# EAGLE design IOB-Baseboard (EAGLE 7.7.0)

## Sheet 1 of 2
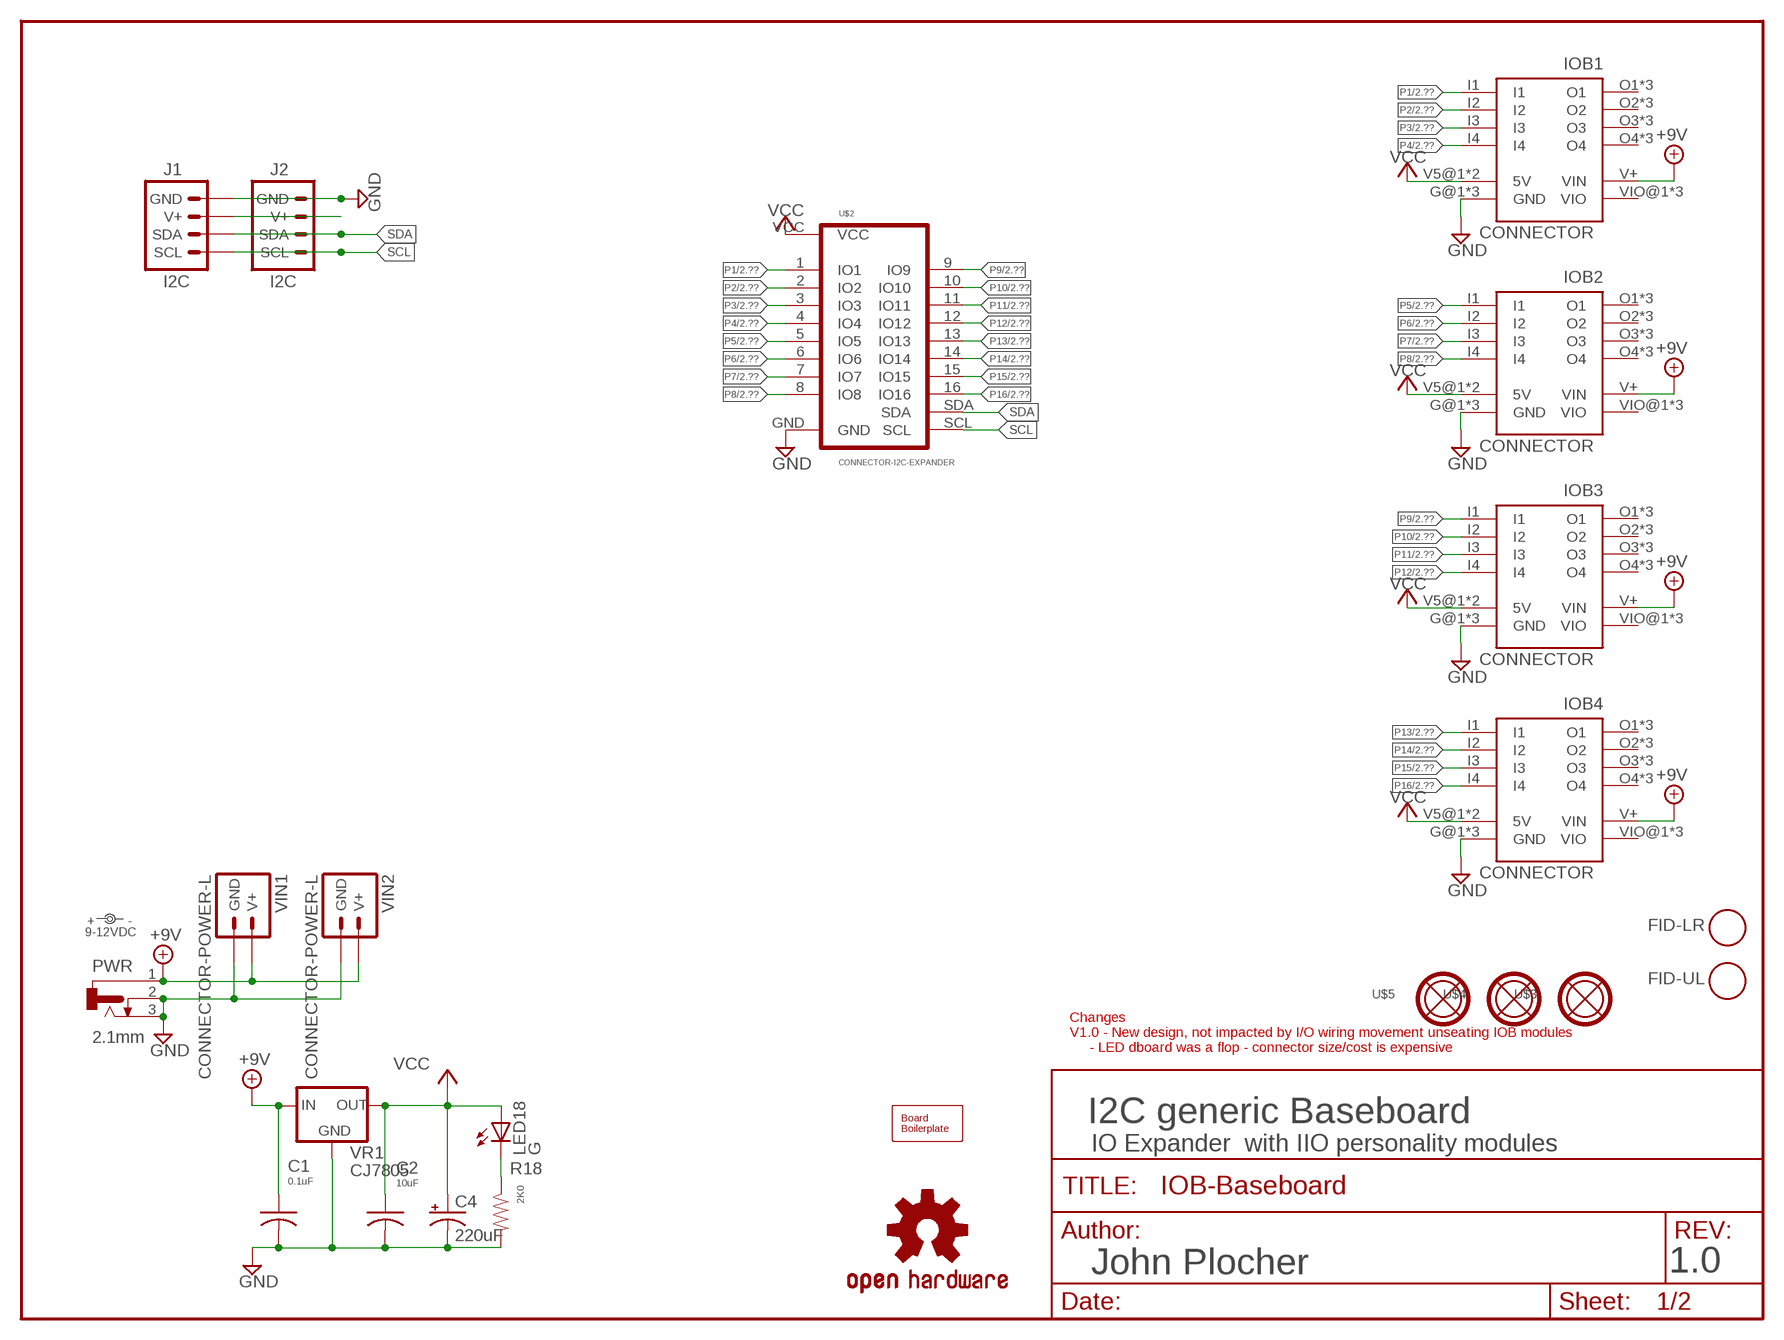
[diagram p0: schematic, sheet 1]

### Parts
BOARD1  BOARD  BOARD80X100-IOB  [BOARD-DINRAIL-3.17IN-IOB]
C1  0.1uF  CAP0603  [0603-CAP]
C2  10uF  CAP0603  [0603-CAP]
C4  220uF  CAP-POL0810  [0810-CAP]
FID-LR  FIDUCIAL  [FIDUCIAL_1MM]
FID-UL  FIDUCIAL  [FIDUCIAL_1MM]
IOB1  CONNECTOR  CONNECTOR-IO4-IOB-V3  [IOB-V3-BASE]
IOB2  CONNECTOR  CONNECTOR-IO4-IOB-V3  [IOB-V3-BASE]
IOB3  CONNECTOR  CONNECTOR-IO4-IOB-V3  [IOB-V3-BASE]
IOB4  CONNECTOR  CONNECTOR-IO4-IOB-V3  [IOB-V3-BASE]
J1  I2C  CONNECTOR-I2CLEFT  [I2C-L]
J2  I2C  CONNECTOR-I2CLEFT  [I2C-L]
LED18  G  LED0603-LED  [0603-LED]
PWR  2.1mm  CONNECTOR-DC-POWER-RA  [DCJ0202]
R18  2K0  R0603-RES  [0603-RES]
U$1  OSHW  OSHW-LOGOL  [OSHW-LOGO-L]
U$2  CONNECTOR-I2C-EXPANDER  [I2C-EXPANDER]
U$3  MOUNTINGHOLE  [MOUNTINGHOLE]
U$4  MOUNTINGHOLE  [MOUNTINGHOLE]
U$5  MOUNTINGHOLE  [MOUNTINGHOLE]
VIN  9-12VDC  DOC-POWER_LABEL  [PWR_LABEL]
VIN1  CONNECTOR-POWER-L  [POWER-R2]
VIN2  CONNECTOR-POWER-L  [POWER-R2]
VR1  CJ7805  VREG-DPAK-5  [TO-252]

### Nets
GND [Power]: C1.2 C2.2 C4.- IOB1.G@1(GND) IOB1.G@2(GND) IOB1.GND@3(GND) IOB2.G@1(GND) IOB2.G@2(GND) IOB2.GND@3(GND) IOB3.G@1(GND) IOB3.G@2(GND) IOB3.GND@3(GND) IOB4.G@1(GND) IOB4.G@2(GND) IOB4.GND@3(GND) J1.GND J1.GND@1(GND) J2.GND J2.GND@1(GND) PWR.2 PWR.3 R18.2 U$2.GND VIN1.GND VIN1.GND@1(GND) VIN1.GND@2(GND) VIN1.GND@3(GND) VIN2.GND VIN2.GND@1(GND) VIN2.GND@2(GND) VIN2.GND@3(GND) VR1.2(GND) ; also sheet 2
N$1: LED18.C R18.1
P1 [signals]: IOB1.I1 U$2.1(IO1) ; also sheet 2
P2 [signals]: IOB1.I2 U$2.2(IO2) ; also sheet 2
P3 [signals]: IOB1.I3 U$2.3(IO3) ; also sheet 2
P4 [signals]: IOB1.I4 U$2.4(IO4) ; also sheet 2
P5 [signals]: IOB2.I1 U$2.5(IO5) ; also sheet 2
P6 [signals]: IOB2.I2 U$2.6(IO6) ; also sheet 2
P7 [signals]: IOB2.I3 U$2.7(IO7) ; also sheet 2
P8 [signals]: IOB2.I4 U$2.8(IO8) ; also sheet 2
P9 [signals]: IOB3.I1 U$2.9(IO9) ; also sheet 2
P10 [signals]: IOB3.I2 U$2.10(IO10) ; also sheet 2
P11 [signals]: IOB3.I3 U$2.11(IO11) ; also sheet 2
P12 [signals]: IOB3.I4 U$2.12(IO12) ; also sheet 2
P13 [signals]: IOB4.I1 U$2.13(IO13) ; also sheet 2
P14 [signals]: IOB4.I2 U$2.14(IO14) ; also sheet 2
P15 [signals]: IOB4.I3 U$2.15(IO15) ; also sheet 2
P16 [signals]: IOB4.I4 U$2.16(IO16) ; also sheet 2
SCL [signals]: J1.SCL J1.SCL@1(SCL) J2.SCL J2.SCL@1(SCL) U$2.SCL
SDA [signals]: J1.SDA J1.SDA@1(SDA) J2.SDA J2.SDA@1(SDA) U$2.SDA
V+I2C: J1.V+ J1.V+@1(V+) J2.V+ J2.V+@1(V+)
VCC [Power]: C2.1 C4.+ IOB1.V5@1(5V) IOB1.V5@2(5V) IOB2.V5@1(5V) IOB2.V5@2(5V) IOB3.V5@1(5V) IOB3.V5@2(5V) IOB4.V5@1(5V) IOB4.V5@2(5V) LED18.A U$2.VCC VR1.3(OUT) ; also sheet 2
VIN [Power]: C1.1 IOB1.V+(VIN) IOB2.V+(VIN) IOB3.V+(VIN) IOB4.V+(VIN) PWR.1 VIN1.V+ VIN1.V+@1(V+) VIN1.V+@2(V+) VIN1.V+@3(V+) VIN2.V+ VIN2.V+@1(V+) VIN2.V+@2(V+) VIN2.V+@3(V+) VR1.1(IN) ; supply symbol labelled +9V
Unconnected: IOB1.O1 IOB1.O1@1(O1) IOB1.O1@2(O1) IOB1.O2 IOB1.O2@1(O2) IOB1.O2@2(O2) IOB1.O3 IOB1.O3@1(O3) IOB1.O3@2(O3) IOB1.O4 IOB1.O4@1(O4) IOB1.O4@2(O4) IOB1.VIO@1(VIO) IOB1.VIO@2(VIO) IOB1.VIO@3(VIO) IOB2.O1 IOB2.O1@1(O1) IOB2.O1@2(O1) IOB2.O2 IOB2.O2@1(O2) IOB2.O2@2(O2) IOB2.O3 IOB2.O3@1(O3) IOB2.O3@2(O3) IOB2.O4 IOB2.O4@1(O4) IOB2.O4@2(O4) IOB2.VIO@1(VIO) IOB2.VIO@2(VIO) IOB2.VIO@3(VIO) IOB3.O1 IOB3.O1@1(O1) IOB3.O1@2(O1) IOB3.O2 IOB3.O2@1(O2) IOB3.O2@2(O2) IOB3.O3 IOB3.O3@1(O3) IOB3.O3@2(O3) IOB3.O4 IOB3.O4@1(O4) IOB3.O4@2(O4) IOB3.VIO@1(VIO) IOB3.VIO@2(VIO) IOB3.VIO@3(VIO) IOB4.O1 IOB4.O1@1(O1) IOB4.O1@2(O1) IOB4.O2 IOB4.O2@1(O2) IOB4.O2@2(O2) IOB4.O3 IOB4.O3@1(O3) IOB4.O3@2(O3) IOB4.O4 IOB4.O4@1(O4) IOB4.O4@2(O4) IOB4.VIO@1(VIO) IOB4.VIO@2(VIO) IOB4.VIO@3(VIO)

### Notes on the sheet
- Changes
  V1.0 - New design, not impacted by I/O wiring movement unseating IOB modules
       - LED dboard was a flop - connector size/cost is expensive
- I2C generic Baseboard
- IO Expander  with IIO personality modules
- John Plocher | 1.0

## Sheet 2 of 2
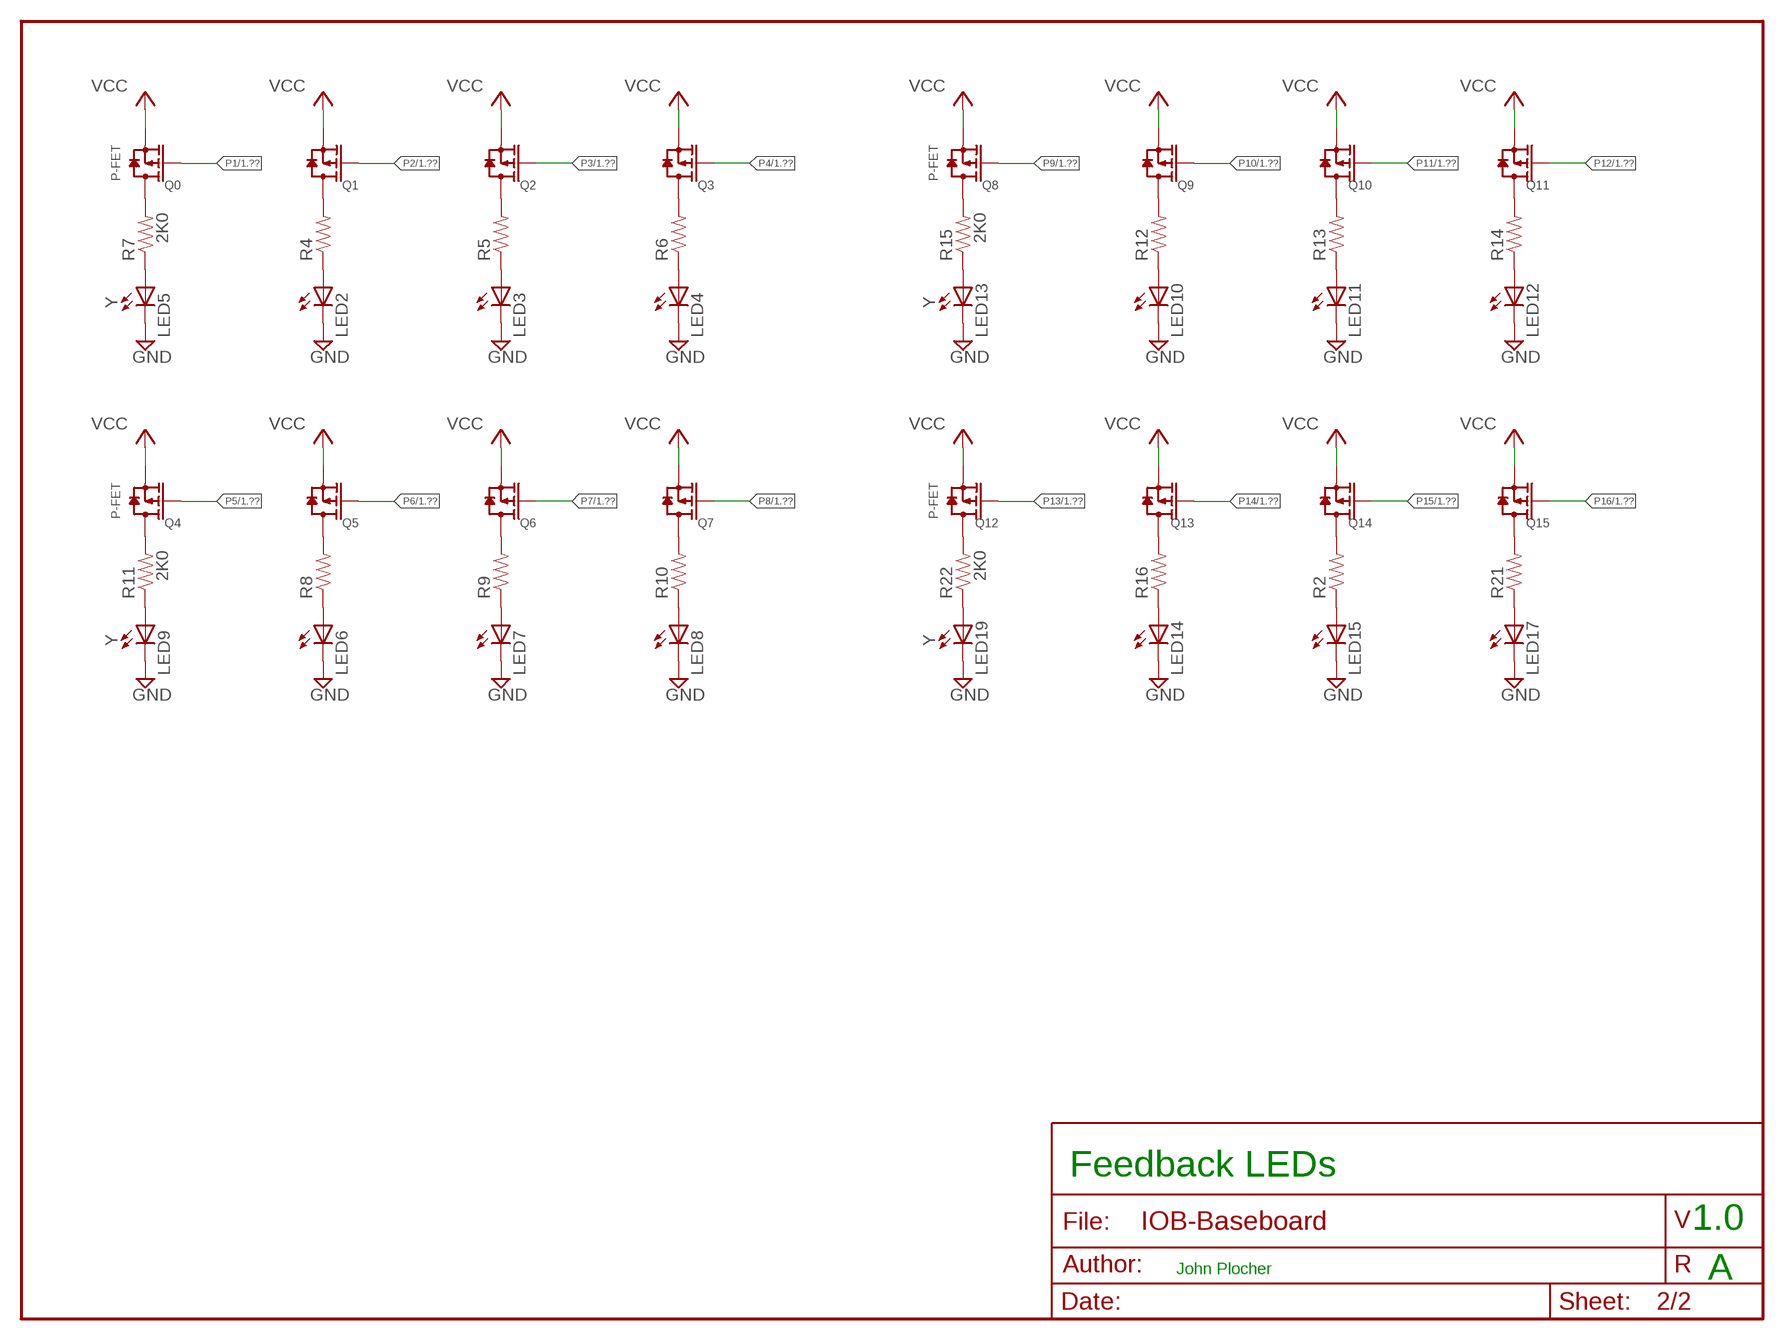
[diagram p1: schematic, sheet 2]

### Parts
LED2  Y  LED0603-LED  [0603-LED]
LED3  Y  LED0603-LED  [0603-LED]
LED4  Y  LED0603-LED  [0603-LED]
LED5  Y  LED0603-LED  [0603-LED]
LED6  Y  LED0603-LED  [0603-LED]
LED7  Y  LED0603-LED  [0603-LED]
LED8  Y  LED0603-LED  [0603-LED]
LED9  Y  LED0603-LED  [0603-LED]
LED10  Y  LED0603-LED  [0603-LED]
LED11  Y  LED0603-LED  [0603-LED]
LED12  Y  LED0603-LED  [0603-LED]
LED13  Y  LED0603-LED  [0603-LED]
LED14  Y  LED0603-LED  [0603-LED]
LED15  Y  LED0603-LED  [0603-LED]
LED17  Y  LED0603-LED  [0603-LED]
LED19  Y  LED0603-LED  [0603-LED]
Q0  P-FET  MOSFET-P-044021001  [SOT23]
Q1  P-FET  MOSFET-P-044021001  [SOT23]
Q2  P-FET  MOSFET-P-044021001  [SOT23]
Q3  P-FET  MOSFET-P-044021001  [SOT23]
Q4  P-FET  MOSFET-P-044021001  [SOT23]
Q5  P-FET  MOSFET-P-044021001  [SOT23]
Q6  P-FET  MOSFET-P-044021001  [SOT23]
Q7  P-FET  MOSFET-P-044021001  [SOT23]
Q8  P-FET  MOSFET-P-044021001  [SOT23]
Q9  P-FET  MOSFET-P-044021001  [SOT23]
Q10  P-FET  MOSFET-P-044021001  [SOT23]
Q11  P-FET  MOSFET-P-044021001  [SOT23]
Q12  P-FET  MOSFET-P-044021001  [SOT23]
Q13  P-FET  MOSFET-P-044021001  [SOT23]
Q14  P-FET  MOSFET-P-044021001  [SOT23]
Q15  P-FET  MOSFET-P-044021001  [SOT23]
R2  2K0  R0603-RES  [0603-RES]
R4  2K0  R0603-RES  [0603-RES]
R5  2K0  R0603-RES  [0603-RES]
R6  2K0  R0603-RES  [0603-RES]
R7  2K0  R0603-RES  [0603-RES]
R8  2K0  R0603-RES  [0603-RES]
R9  2K0  R0603-RES  [0603-RES]
R10  2K0  R0603-RES  [0603-RES]
R11  2K0  R0603-RES  [0603-RES]
R12  2K0  R0603-RES  [0603-RES]
R13  2K0  R0603-RES  [0603-RES]
R14  2K0  R0603-RES  [0603-RES]
R15  2K0  R0603-RES  [0603-RES]
R16  2K0  R0603-RES  [0603-RES]
R21  2K0  R0603-RES  [0603-RES]
R22  2K0  R0603-RES  [0603-RES]

### Nets
GND [Power]: LED2.C LED3.C LED4.C LED5.C LED6.C LED7.C LED8.C LED9.C LED10.C LED11.C LED12.C LED13.C LED14.C LED15.C LED17.C LED19.C ; also sheet 1
N$3: Q4.3(D) R11.2
N$4: Q5.3(D) R8.2
N$5: Q6.3(D) R9.2
N$6: Q7.3(D) R10.2
N$7: LED9.A R11.1
N$8: LED6.A R8.1
N$9: LED7.A R9.1
N$10: LED8.A R10.1
N$11: Q8.3(D) R15.2
N$12: Q9.3(D) R12.2
N$13: Q10.3(D) R13.2
N$14: Q11.3(D) R14.2
N$15: LED13.A R15.1
N$16: LED10.A R12.1
N$23: LED11.A R13.1
N$24: LED12.A R14.1
N$28: Q12.3(D) R22.2
N$29: Q13.3(D) R16.2
N$30: Q14.3(D) R2.2
N$31: Q15.3(D) R21.2
N$32: LED19.A R22.1
N$33: LED14.A R16.1
N$34: LED15.A R2.1
N$35: LED17.A R21.1
N$44: Q0.3(D) R7.2
N$45: Q1.3(D) R4.2
N$46: Q2.3(D) R5.2
N$47: Q3.3(D) R6.2
N$48: LED5.A R7.1
N$49: LED2.A R4.1
N$50: LED3.A R5.1
N$51: LED4.A R6.1
P1 [signals]: Q0.1(G) ; also sheet 1
P2 [signals]: Q1.1(G) ; also sheet 1
P3 [signals]: Q2.1(G) ; also sheet 1
P4 [signals]: Q3.1(G) ; also sheet 1
P5 [signals]: Q4.1(G) ; also sheet 1
P6 [signals]: Q5.1(G) ; also sheet 1
P7 [signals]: Q6.1(G) ; also sheet 1
P8 [signals]: Q7.1(G) ; also sheet 1
P9 [signals]: Q8.1(G) ; also sheet 1
P10 [signals]: Q9.1(G) ; also sheet 1
P11 [signals]: Q10.1(G) ; also sheet 1
P12 [signals]: Q11.1(G) ; also sheet 1
P13 [signals]: Q12.1(G) ; also sheet 1
P14 [signals]: Q13.1(G) ; also sheet 1
P15 [signals]: Q14.1(G) ; also sheet 1
P16 [signals]: Q15.1(G) ; also sheet 1
VCC [Power]: Q0.2(S) Q1.2(S) Q2.2(S) Q3.2(S) Q4.2(S) Q5.2(S) Q6.2(S) Q7.2(S) Q8.2(S) Q9.2(S) Q10.2(S) Q11.2(S) Q12.2(S) Q13.2(S) Q14.2(S) Q15.2(S) ; also sheet 1

### Notes on the sheet
- Feedback LEDs
- 1.0
- John Plocher
- A

## Library data of the parts
BOARD1 = SPCoast:BOARD
C1 C2 = SPCoast:CAP*
C4 = SPCoast:CAP-POL*
FID-LR FID-UL = SPCoast:FIDUCIAL: For use by pick and place machines to calibrate the vision/machine, 1mm By microbuilder.eu
IOB1-IOB4 = SPCoast:CONNECTOR-IO4-IOB-V3
J1 J2 = SPCoast:CONNECTOR-I2C
LED2-LED15 LED17-LED19 = SPCoast:LED*
PWR = SPCoast:CONNECTOR-DC-POWER: DC POWER JACK
Q0 Q1-Q15 = SPCoast:MOSFET-P: CJ2305：SMD MOSFET P-CH 8V-4.1A
R2 R4-R16 R18 R21 R22 = SPCoast:R*: Resistor Basic schematic elements and footprints for 0603, 1206, and PTH 1/10th watt (small) resistors.
U$1 = SparkFun:OSHW-LOGO: Open Source Hardware Logo This logo indicates the piece of hardware it is found on incorporates a OSHW license and/or adheres to the definition of open source hardware found here: http://freedomdefined.org/OSHW
U$2 = SPCoast:CONNECTOR-I2C-EXPANDER
U$3-U$5 = SPCoast:MOUNTINGHOLE: Mounting hole with top and bottom copper and stop rings
VIN = SPCoast:DOC-POWER_LABEL
VIN1 VIN2 = SPCoast:CONNECTOR-POWER
VR1 = SPCoast:VREG-?-*: Voltage Regulator Standard linear regulator. 7805 uses IGO pinout LM1117 uses GOI pinout

## Net classes
0 default: width 0.254 mm, drill 0.4 mm, clearance 0.127 mm
1 Power: width 0.254 mm, drill 0.4 mm, clearance 0.127 mm
2 signals: width 0.254 mm, drill 0.4 mm, clearance 0.127 mm

## Board
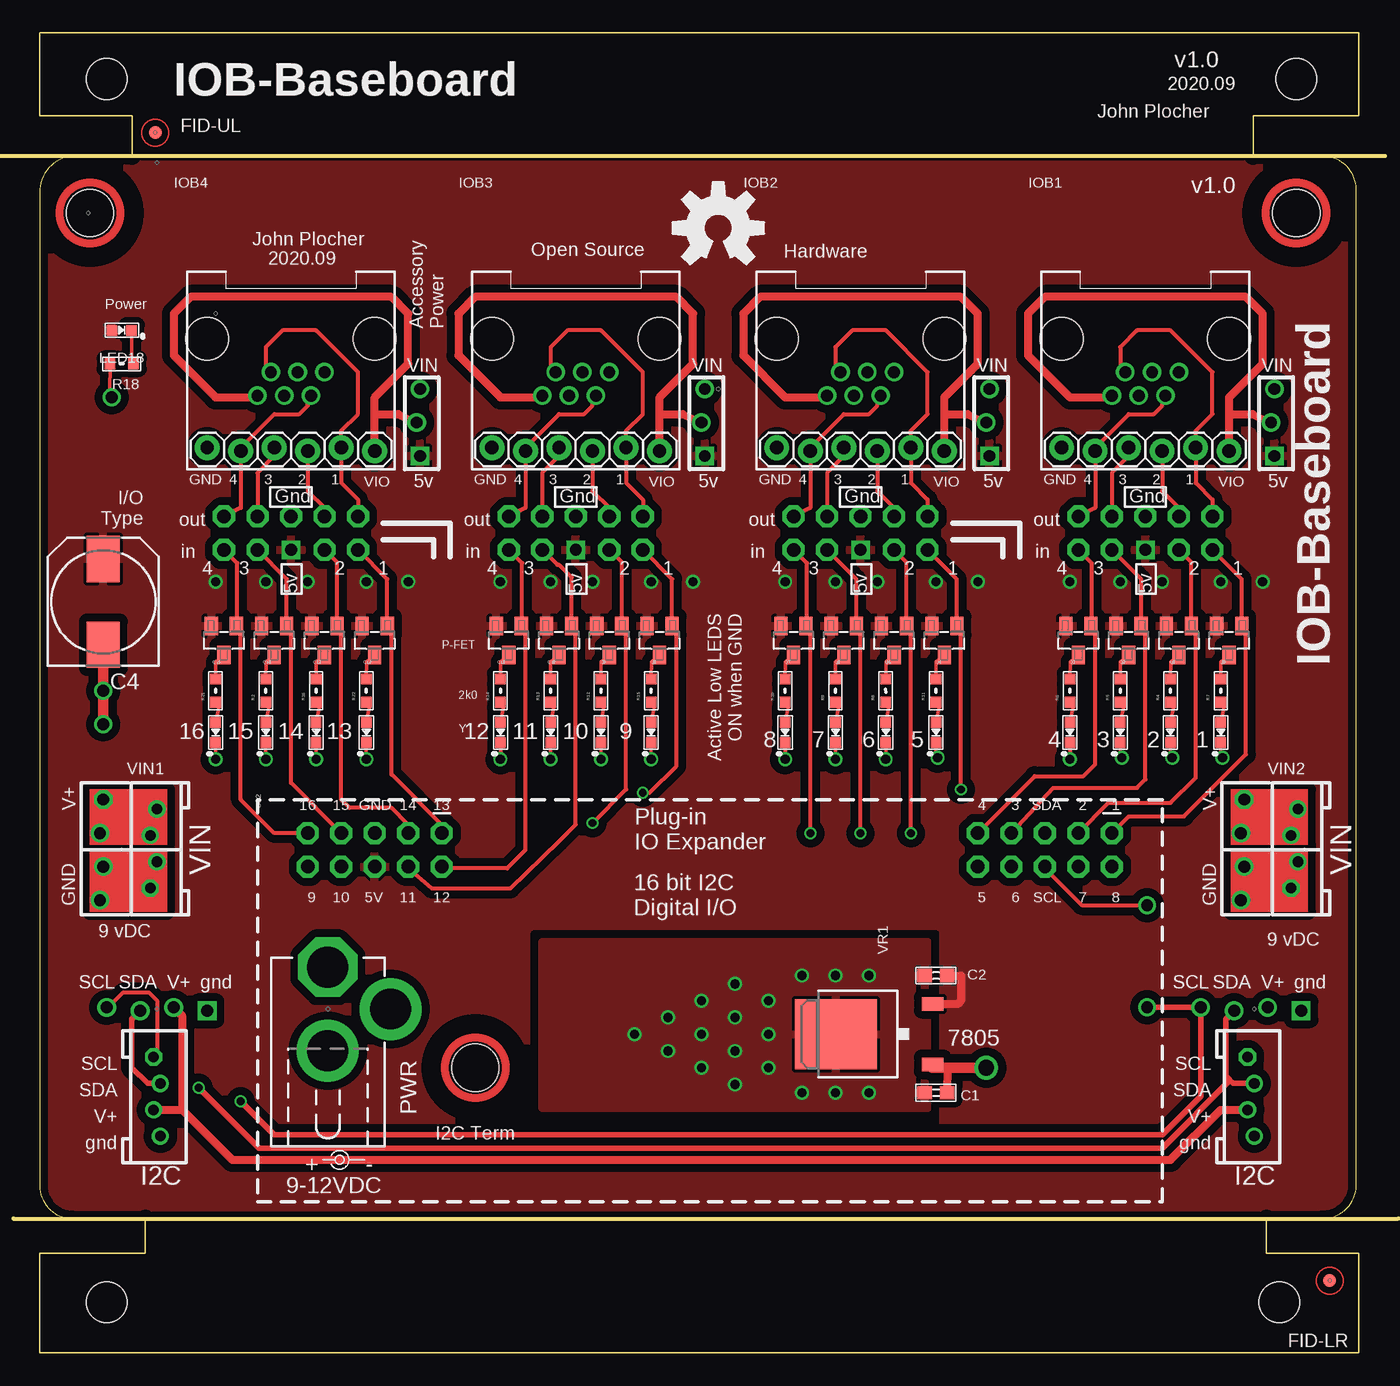
[diagram p2: board, top side]
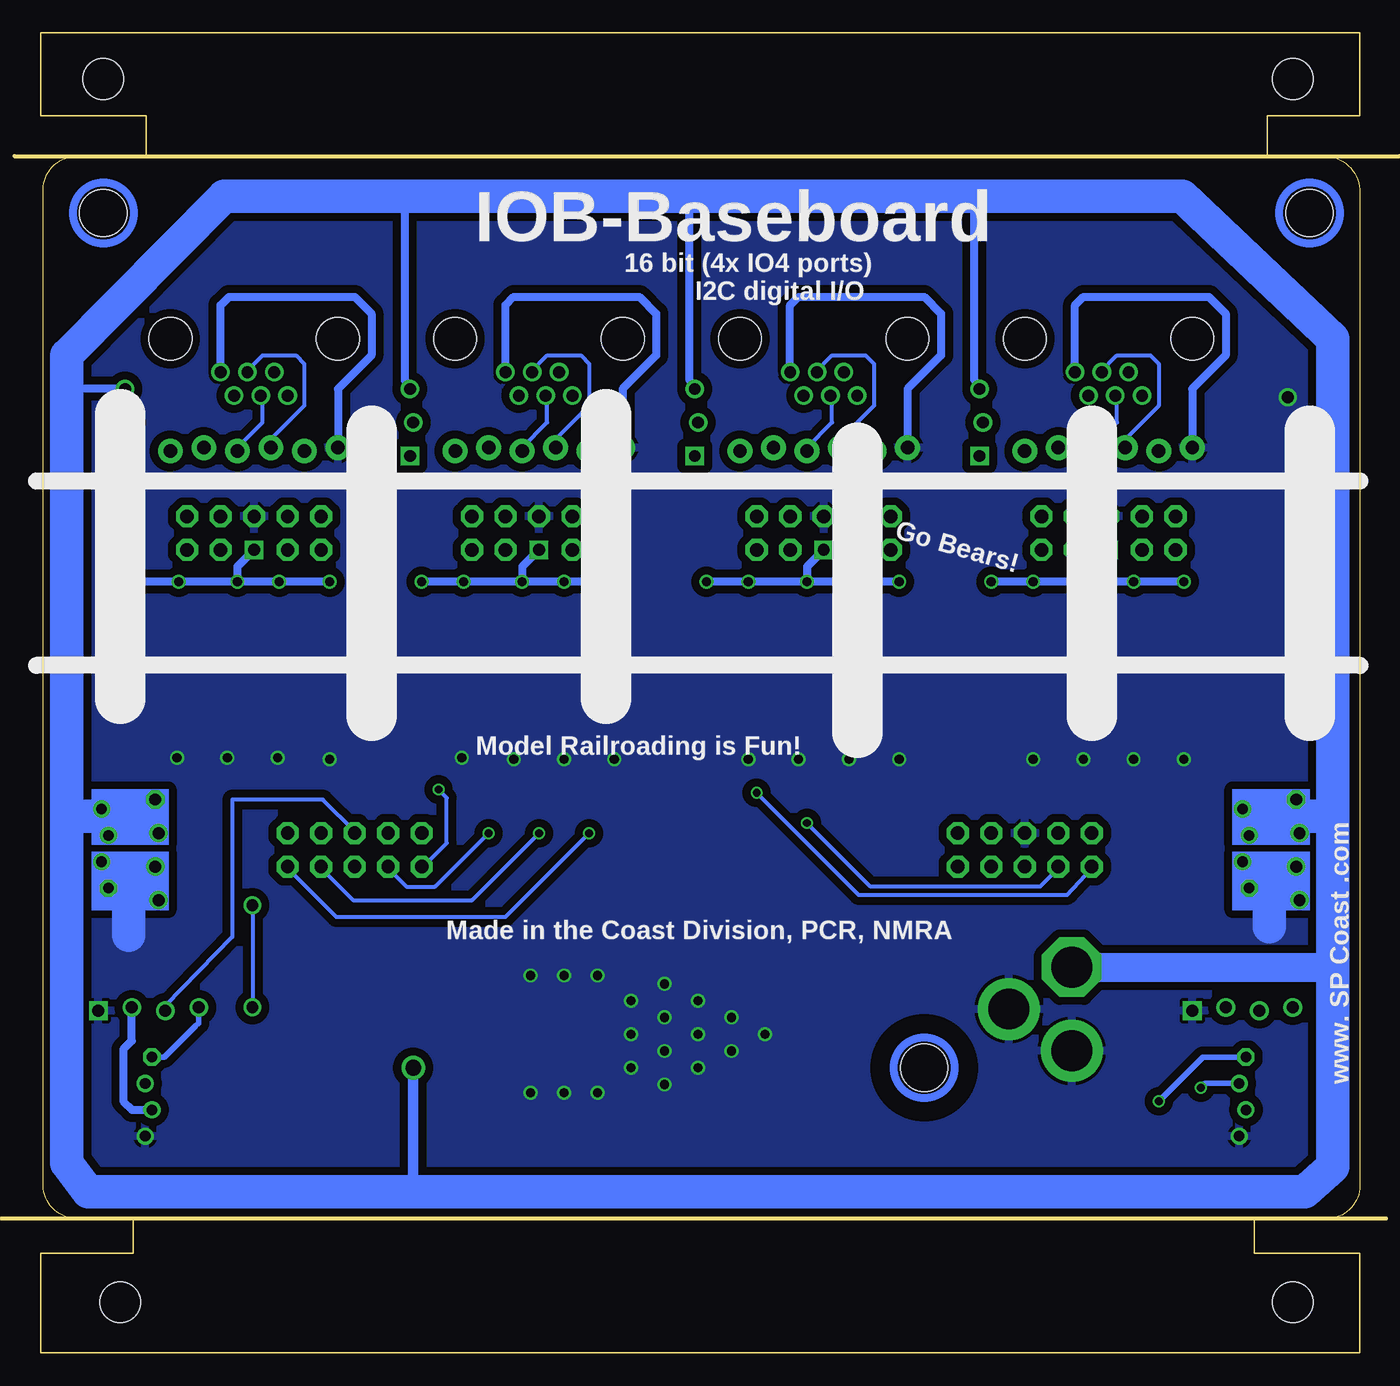
[diagram p3: board, bottom side, seen from below]

Size 100.01 x 100 mm. Coordinates in mm from the lower left corner, seen from the top.
Copper layers (1*16): Top 0.035mm / dielectric 1.5mm / Bottom 0.035mm
Design rules "Fusion_eagle_rule_v1.1": minimum track width 6mil, minimum drill 12mil, track to track 6mil, track to pad 6mil, pad to pad 6mil, via to via 6mil, smd to smd 0mil, copper to edge 10mil, drill to drill 10mil, minimum pad ring 10mil, minimum via ring 6mil, stop-mask expansion 2mil, vias tented up to drill 100mil, thermal gap 10mil

### Footprints (pad centres in the part's own frame; a part is rotated, then mirrored left to right if it is on the bottom)
BOARD-DINRAIL-3.17IN-IOB = hole 3.1: 5.08,96.52; 95.25,96.52; 5.08,3.81; 93.98,3.81
0603-CAP = smd 1.1 x 1: 1 -0.85,0; 2 0.85,0
0810-CAP = smd 3.5 x 2.5: + 3.25,0; - -3.25,0
FIDUCIAL_1MM = smd 1 x 1: 1 0,0
IOB-V3-BASE = drill 1.016 pad 1.676 octagon: G@1 26.797,10.16; I1 29.337,15.24; I2 29.337,12.7; I3 29.337,7.62; I4 29.337,5.08; O1 26.797,15.24; O2 26.797,12.7; O3 26.797,7.62; O4 26.797,5.08 | drill 1.016 pad 1.88: G@2 21.59,3.81; O1@1 21.59,13.97; O2@1 21.844,11.43; O3@1 21.59,8.89; O4@1 21.844,6.35; VIO@2 21.844,16.51 | drill 0.9 pad 1.4: GND@3 15.875,12.7; O1@2 15.875,8.636; O2@2 17.653,9.652; O3@2 15.875,10.668; O4@2 17.653,11.684; VIO@3 17.653,7.62 | drill 0.9 square: V5@1 29.337,10.16; V5@2 22.225,19.939 | drill 0.9: V+ 17.145,19.939; VIO@1 19.685,19.685 | hole 3.251: 13.335,16.51; 13.335,3.81
I2C-L = drill 0.9 square: GND 3.81,-0.127 | drill 0.8 pad 1.27: GND@1 0.254,-9.635; SDA@1 0.254,-5.635; V+@1 -0.254,-7.635 | drill 0.9: SCL -3.81,0.127; SDA -1.27,-0.127; V+ 1.27,0.127 | drill 0.8 pad 1.27 octagon: SCL@1 -0.254,-3.635
0603-LED = smd 0.8 x 0.8: A 0.75,0; C -0.75,0
DCJ0202 = drill 3.1 pad 4.5 octagon: 1 0,3.175 | drill 3.1 pad 4.7: 2 4.763,0; 3 0,-3.175
SOT23 = smd 1.4 x 1: 1 1.1,-0.95; 2 1.1,0.95; 3 -1.1,0
0603-RES = smd 0.813 x 0.813: 1 -0.889,0; 2 0.889,0
I2C-EXPANDER = drill 1.016 pad 1.676 octagon: 1 30.48,1.27; 2 27.94,1.27; 3 22.86,1.27; 4 20.32,1.27; 5 20.32,-1.27; 6 22.86,-1.27; 7 27.94,-1.27; 8 30.48,-1.27; 9 -30.48,-1.27; 10 -27.94,-1.27; 11 -22.86,-1.27; 12 -20.32,-1.27; 13 -20.32,1.27; 14 -22.86,1.27; 15 -27.94,1.27; 16 -30.48,1.27; GND -25.4,1.27; SCL 25.4,-1.27; SDA 25.4,1.27; VCC -25.4,-1.27
MOUNTINGHOLE = hole 3.6: 0,0
POWER-R2 = drill 0.9: GND -3.302,-1.27; GND@1 -3.556,-3.81; V+ -3.556,1.27 | drill 0.8 pad 1.27: GND@2 0.762,-0.904; V+@2 0.762,3.096; V+@3 0.254,1.096 | drill 0.8 pad 1.27 octagon: GND@3 0.254,-2.904 | drill 0.9 octagon: V+@1 -3.302,3.81
TO-252 = smd 1.651 x 1.016: 1 -4.826,2.286; 3 -4.826,-2.286 | smd 6.2 x 5.3: 2 2.5,0

### Placement (x,y rotation side)
BOARD1  0.01,0 0 top
C1  67.96,19.68 180 top
C2  67.96,28.57 180 top
C4  4.84,56.9 90 top
FID-LR  97.8,5.46 0 top
FID-UL  8.78,92.46 0 top
IOB1  73.67,90.17 270 top
IOB2  52.08,90.17 270 top
IOB3  30.49,90.17 270 top
IOB4  8.9,90.17 270 top
J1  91.83,26.04 0 top
J2  8.9,26.04 0 top
LED2  85.74,46.99 90 top
LED3  81.93,46.99 90 top
LED4  78.12,46.99 90 top
LED5  89.55,46.99 90 top
LED6  64.15,46.99 90 top
LED7  60.34,46.99 90 top
LED8  56.53,46.99 90 top
LED9  67.96,46.99 90 top
LED10  42.56,46.99 90 top
LED11  38.75,46.99 90 top
LED12  34.94,46.99 90 top
LED13  46.37,46.99 90 top
LED14  20.97,46.99 90 top
LED15  17.16,46.99 90 top
LED17  13.35,46.99 90 top
LED18  6.24,77.47 180 top
LED19  24.78,46.99 90 top
PWR  21.86,26.04 0 top
Q0  90.18,53.98 90 top
Q1  86.37,53.98 90 top
Q2  82.56,53.98 90 top
Q3  78.75,53.98 90 top
Q4  68.59,53.98 90 top
Q5  64.78,53.98 90 top
Q6  60.97,53.98 90 top
Q7  57.16,53.98 90 top
Q8  47,53.98 90 top
Q9  43.19,53.98 90 top
Q10  39.38,53.98 90 top
Q11  35.57,53.98 90 top
Q12  25.41,53.98 90 top
Q13  21.6,53.98 90 top
Q14  17.79,53.98 90 top
Q15  13.98,53.98 90 top
R2  17.16,50.16 90 top
R4  85.74,50.16 90 top
R5  81.93,50.16 90 top
R6  78.12,50.16 90 top
R7  89.55,50.16 90 top
R8  64.15,50.16 90 top
R9  60.34,50.16 90 top
R10  56.53,50.16 90 top
R11  67.96,50.16 90 top
R12  42.56,50.16 90 top
R13  38.75,50.16 90 top
R14  34.94,50.16 90 top
R15  46.37,50.16 90 top
R16  20.97,50.16 90 top
R18  6.24,74.93 180 top
R21  13.35,50.16 90 top
R22  24.78,50.16 90 top
U$1  51.45,85.22 0 top
U$2  50.81,38.1 0 top
U$3  3.82,86.36 0 top
U$4  33.03,21.59 0 top
U$5  95.26,86.36 0 top
VIN  22.75,14.61 90 top
VIN1  8.14,38.1 0 top
VIN2  94.63,38.1 0 top
VR1  62.88,24.13 180 top

### Tracks (layer width: path | path; a pad name or v marks a point on that pad's centre or on a via)
GND  (via drill 0.7, 0.9)
  Top 0.254: R18.2 5.34,72.78 5.73,72.39 v5.47,72.39 | 13.35,46.23 v13.35,44.96 | LED15.C v17.16,44.96 | LED14.C v20.97,44.96 | LED19.C v24.78,44.96 | LED7.C v60.34,44.96 | LED6.C v64.15,44.96 | LED9.C 67.96,45.21 v68.09,45.09 | LED3.C 81.93,45.21 v82.06,45.09 | LED2.C 85.74,45.21 v85.87,45.09 | LED5.C 89.55,45.21 v89.68,45.09 | LED11.C v38.75,44.96 | LED10.C v42.56,44.96 | LED13.C v46.37,44.96
  Top 0.305: LED4.C v78.12,44.96 | LED8.C v56.53,44.96 | LED12.C v34.94,44.96 | LED17.C 13.35,46.23
  Top 0.813: C4.- v4.84,50.16 v4.84,47.62 4.84,47.5
  Bottom 0.813: VIN1.GND@1 5.49,35.2 VIN1.GND@3 8.9,35.7 VIN1.GND@2 8.54,36.83 VIN1.GND 4.84,36.7 6.87,34.67 | VIN2.GND 91.07,36.58 VIN2.GND@1 91.98,35.2 VIN2.GND@3 | 95.02,36.83 95.02,35.34 VIN2.GND@3 | VIN2.GND 95.02,36.83 | 95.02,36.83 VIN2.GND@2 95.39,35.7 VIN2.GND@3 | VIN2.GND 91.33,36.7 93.36,34.67
  Bottom 2.54: 6.87,34.67 6.87,32.26 | 93.36,34.67 93.36,31.62
  other vias: 55.26,24.13 55.26,26.67 55.26,21.59 57.8,28.57 60.34,28.57 62.88,28.57 57.8,19.68 60.34,19.68 62.88,19.68 52.72,25.4 50.18,26.67 50.18,24.13 50.18,21.59 52.72,22.86 52.72,20.32 52.72,27.94 47.64,22.86 47.64,25.4 45.1,24.13
  pour Bottom (isolate 0.61, rank 2): 100.01,10 100.01,90 0.01,90 0.01,10
  pour Top (isolate 0.61): 67.32,31.11 38.11,31.11 38.11,18.54 67.32,18.54
N$1
  Top 0.254: R18.1 7,74.93 6.99,74.94 LED18.C
N$3
  Top 0.254: Q4.3 67.97,52.34 R11.2
N$4
  Top 0.254: Q5.3 64.16,52.34 R8.2
N$5
  Top 0.254: Q6.3 60.35,52.34 R9.2
N$6
  Top 0.254: Q7.3 56.54,52.34 R10.2
N$7
  Top 0.254: R11.1 68.21,49.01 LED9.A
N$8
  Top 0.254: R8.1 64.4,49.01 LED6.A
N$9
  Top 0.254: R9.1 60.59,49.01 LED7.A
N$10
  Top 0.254: R10.1 56.78,49.01 LED8.A
N$11
  Top 0.254: Q8.3 46.38,52.34 R15.2
N$12
  Top 0.254: Q9.3 42.57,52.34 R12.2
N$13
  Top 0.254: Q10.3 38.76,52.34 R13.2
N$14
  Top 0.254: Q11.3 34.95,52.34 R14.2
N$15
  Top 0.254: R15.1 46.62,49.01 LED13.A
N$16
  Top 0.254: R12.1 42.81,49.01 LED10.A
N$23
  Top 0.254: R13.1 39,49.01 LED11.A
N$24
  Top 0.254: R14.1 35.19,49.01 LED12.A
N$28
  Top 0.254: Q12.3 24.79,52.34 R22.2
N$29
  Top 0.254: Q13.3 20.98,52.34 R16.2
N$30
  Top 0.254: Q14.3 17.17,52.34 R2.2
N$31
  Top 0.254: Q15.3 13.36,52.34 R21.2
N$32
  Top 0.254: R22.1 25.03,49.01 LED19.A
N$33
  Top 0.254: R16.1 21.22,49.01 LED14.A
N$34
  Top 0.254: R2.1 17.41,49.01 LED15.A
N$35
  Top 0.254: R21.1 13.6,49.01 LED17.A
N$44
  Top 0.254: Q0.3 89.56,52.34 R7.2
N$45
  Top 0.254: Q1.3 85.75,52.34 R4.2
N$46
  Top 0.254: Q2.3 81.94,52.34 R5.2
N$47
  Top 0.254: Q3.3 78.13,52.34 R6.2
N$48
  Top 0.254: R7.1 89.8,49.01 LED5.A
N$49
  Top 0.254: R4.1 85.99,49.01 LED2.A
N$50
  Top 0.254: R5.1 82.18,49.01 LED3.A
N$51
  Top 0.254: R6.1 78.37,49.01 LED4.A
P1
  Top 0.305: IOB1.I1 91.13,58.61 Q0.1 91.13,54.93 91.45,54.61 91.45,45.34 86.75,40.64 82.56,40.64 U$2.1
P2
  Top 0.305: IOB1.I2 87.32,59.88 Q1.1 87.32,54.93 87.64,54.61 87.64,43.56 85.74,41.66 81.04,41.66 U$2.2
P3
  Top 0.305: IOB1.I3 83.51,58.61 Q2.1 83.51,54.93 83.83,54.61 83.83,43.43 83.2,42.8 76.85,42.8 U$2.3
P4
  Top 0.254: Q3.1 80.02,55.4 79.77,55.65
  Top 0.305: 79.77,55.65 79.77,59.82 IOB1.I4 | U$2.4 75.45,43.69 79.13,43.69 80.02,44.58 80.02,54.61 79.7,54.93 Q3.1
P5  (via drill 0.6)
  Top 0.305: v69.86,42.67 69.86,54.76 Q4.1 69.54,58.61 IOB2.I1
  Bottom 0.305: U$2.5 71.01,36.83 69.23,38.61 69.23,42.04 v69.86,42.67
P6  (via drill 0.6)
  Top 0.305: v66.05,39.37 66.05,54.76 Q5.1 65.73,59.88 IOB2.I2
  Bottom 0.305: v66.05,39.37 70.12,35.31 72.28,35.31 73.67,36.7 U$2.6
P7  (via drill 0.6)
  Top 0.305: v62.24,39.37 62.24,54.76 Q6.1 61.92,58.61 IOB2.I3
  Bottom 0.305: v62.24,39.37 67.32,34.29 76.34,34.29 78.75,36.7 U$2.7
P8  (via drill 0.6)
  Top 0.254: 58.18,55.65 58.43,55.4 Q7.1 58.18,55.14
  Top 0.305: v58.43,39.37 58.43,54.76 Q7.1 | 58.18,55.65 58.18,59.82 IOB2.I4
  Bottom 0.305: v58.43,39.37 64.78,33.02 77.61,33.02 81.29,36.7 U$2.8
P9  (via drill 0.6)
  Top 0.305: v45.73,42.42 46.24,42.42 48.27,44.45 48.27,54.76 Q8.1 47.95,58.61 IOB3.I1
  Bottom 0.305: v45.73,42.42 37.99,34.67 22.24,34.67 20.33,36.7 U$2.9
P10  (via drill 0.6)
  Top 0.305: v41.92,40.13 44.46,42.67 44.46,54.76 Q9.1 44.14,59.88 IOB3.I2
  Bottom 0.305: v41.92,40.13 37.1,35.31 24.27,35.31 22.87,36.7 U$2.10
P11
  Top 0.305: U$2.11 27.95,36.7 29.73,35.18 35.7,35.18 39.38,38.73 40.65,40.01 40.65,54.76 Q10.1 40.33,58.74 39.38,59.69 39.26,59.69 IOB3.I3
P12
  Top 0.254: Q11.1 36.84,55.4 36.59,55.65
  Top 0.305: U$2.12 30.62,36.7 35.45,36.7 36.84,38.1 36.84,54.76 Q11.1 | 36.59,55.65 36.59,59.82 IOB3.I4
P13
  Top 0.305: IOB4.I1 26.36,58.61 Q12.1 26.36,54.93 26.68,54.61 26.68,43.81 30.49,40.01 U$2.13
P14
  Top 0.305: IOB4.I2 22.55,59.88 Q13.1 22.87,54.76 22.87,41.91 23.51,41.27 26.68,41.27 27.95,40.01 U$2.14
P15
  Top 0.305: IOB4.I3 18.74,58.61 Q14.1 19.06,54.76 19.06,43.18 U$2.15
P16
  Top 0.305: IOB4.I4 15,59.82 15,55.14 Q15.1 15.25,54.76 15.25,41.91 17.79,39.37 U$2.16
SCL  (via drill 0.6, 0.9)
  Top 0.305: J2.SCL 5.22,26.16 6.36,27.3 8.27,27.3 8.9,26.67 8.9,22.65 J2.SCL@1 | v83.96,33.91 79.01,33.91 76.21,36.7 U$2.SCL
  Top 0.406: v83.96,26.16 J1.SCL 88.02,19.43 85.1,16.51 17.79,16.51 v15.25,19.05
  Bottom 0.305: v83.96,33.91 v83.96,26.16
  Bottom 0.406: J2.SCL@1 11.9,22.4 v15.25,19.05 | J1.SCL 88.02,24.94 88.28,24.77 90.64,22.4 J1.SCL@1
SDA  (via drill 0.6)
  Top 0.406: J2.SDA 7,25.27 7,21.59 8.19,20.4 J2.SDA@1 | J1.SDA 89.93,25.27 89.93,20.95 90.25,20.64 | 90.25,20.64 90.48,20.4 J1.SDA@1 | v12.08,20.07 16.65,15.49 85.1,15.49 90.25,20.64
  Bottom 0.305: J1.SDA 90.56,26.29 85.48,31.5 85.48,41.91 78.63,41.91 76.21,39.5 U$2.SDA
  Bottom 0.406: J2.SDA@1 11.74,20.4 v12.08,20.07
V+I2C
  Top 0.61: J2.V+ 10.81,25.53 10.81,18.41 | J2.V+@1 8.66,18.41 10.81,18.41 | 10.81,18.41 14.62,14.61 85.74,14.61 89.53,18.4 J1.V+@1 91.18,18.4
  Bottom 0.61: J1.V+@1 93.09,18.4 93.74,19.05 93.74,22.99 93.1,23.62 J1.V+
VCC  (via drill 0.7)
  Top 0.254: 89.17,55.63 89.23,55.56 | 85.48,55.63 85.42,55.56 | 81.67,55.63 81.61,55.56 81.75,55.56 81.93,55.39 | 77.86,55.63 77.8,55.56 77.94,55.56 78.12,55.39 Q3.2 | 85.1,55.4 Q1.2 | 67.58,55.63 67.64,55.56 | 63.89,55.63 63.83,55.56 | 56.27,55.63 56.21,55.56 56.35,55.56 56.53,55.39 | 45.99,55.63 46.05,55.56 45.73,55.24 | 42.3,55.63 42.24,55.56 | 38.49,55.63 38.43,55.56 38.57,55.56 38.75,55.39 | 34.68,55.63 34.62,55.56 34.76,55.56 | 13.09,55.63 13.03,55.56 | Q4.2 67.32,54.76 67.32,54.61 | 88.91,54.76 88.91,54.61
  Top 0.305: Q0.2 89.23,54.93 88.91,54.61
  Top 0.61: C2.1 69.86,28.57 69.86,26.67 69.61,26.42 VR1.3
  Bottom 0.61: v78.12,58.42 v81.93,58.42 v85.1,58.42 | v85.1,58.42 v89.55,58.42 v92.72,58.42 | v56.53,58.42 v60.34,58.42 v63.51,58.42 | v63.51,58.42 v67.96,58.42 v71.13,58.42 | v34.94,58.42 v38.75,58.42 v41.92,58.42 | v41.92,58.42 v46.37,58.42 v49.54,58.42 | v13.35,58.42 v17.16,58.42 v20.33,58.42 | v20.33,58.42 v24.78,58.42 v27.95,58.42 | v20.33,58.42 20.33,59.56 IOB4.V5@1 | IOB2.V5@1 63.51,59.56 v63.51,58.42 | IOB3.V5@1 41.92,59.56 v41.92,58.42 | IOB1.V5@1 85.1,59.56 v85.1,58.42
  pour Top (isolate 0.61, rank 2): 100.01,11 100.01,90 0.01,90 0.01,11
VIN  (via drill 1.2)
  Top 0.406: 67.72,21.86 VR1.1 67.7,21.59
  Top 0.61: C1.1 68.86,21.59
  Top 0.813: v71.77,21.59 68.86,21.59 67.7,21.59
  Bottom 0.61: IOB1.V+ 97.17,73.03 97.3,73.15 97.93,73.15 98.06,63.5 | IOB2.V+ 71.9,73.15 72.4,73.66 72.4,87.63 | IOB3.V+ 50.31,73.15 50.81,73.66 50.81,87.63 | IOB4.V+ 28.72,73.15 29.22,73.66 29.22,87.63 | VIN2.V+@1 91.07,41.66 VIN2.V+ | VIN2.V+@2 95.39,40.64 93.99,40.64
  Bottom 0.813: 48.78,87.63 50.81,87.63 | VIN1.V+@1 8.19,41.91 VIN1.V+@2 8.9,39.7 VIN1.V+@3 4.76,39.2 VIN1.V+ 4.59,40.13 5.09,40.64 | VIN2.V+@1 94.68,41.91 VIN2.V+@2 | 97.85,41.7 98.06,41.91 | v71.77,21.59 71.77,12.19 72.4,12.19 | VIN2.V+ 94.71,39.37 VIN2.V+@3 91.25,39.2 VIN2.V+
  Bottom 2.184: PWR.1 2.05,29.21 arc-45 2.05,29.21
  Bottom 2.54: 2.05,40.64 2.06,39.36 2.05,29.21 2.05,14.1 4.2,12.19 72.4,12.19 96.41,12.19 98.06,14.35 98.06,40.64 | 2.05,40.64 2.05,41.27 2.05,76.83 13.48,87.63 29.22,87.63 50.81,87.63 72.4,87.63 86.12,87.63 98.06,75.56 98.06,63.5 98.06,41.91 98.06,40.64 | 5.09,40.64 2.05,40.64 | 93.99,40.64 98.06,40.64
(copper drawn outside any net)
  shapes: Bottom area x4, Top area x4

### Text on the board
tPlace: v1.0 | 2020.09 | John Plocher | v1.0 | John Plocher | 2020.09 | Open Source | Hardware | Power | Accessory / Power | I/O / Type | Active Low LEDS / ON when GND | P-FET | 2k0 | Y | 16 | 15 | 14 | 13 | 12 | 11 | 10 | 9 | 8 | 7 | 6 | 5 | 4 | 3 | 2 | 1 | Plug-in / IO Expander | 16 bit I2C / Digital I/O | 9 vDC | 9 vDC | 7805 | I2C Term
bPlace: 16 bit (4x IO4 ports) / I2C digital I/O | Go Bears! | Model Railroading is Fun! | www. SP Coast .com | Made in the Coast Division, PCR, NMRA